# Altium schematic sheet L3_GSM.SchDoc
size 469 x 281 mm; SheetNumber: 1; SheetTotal: 1
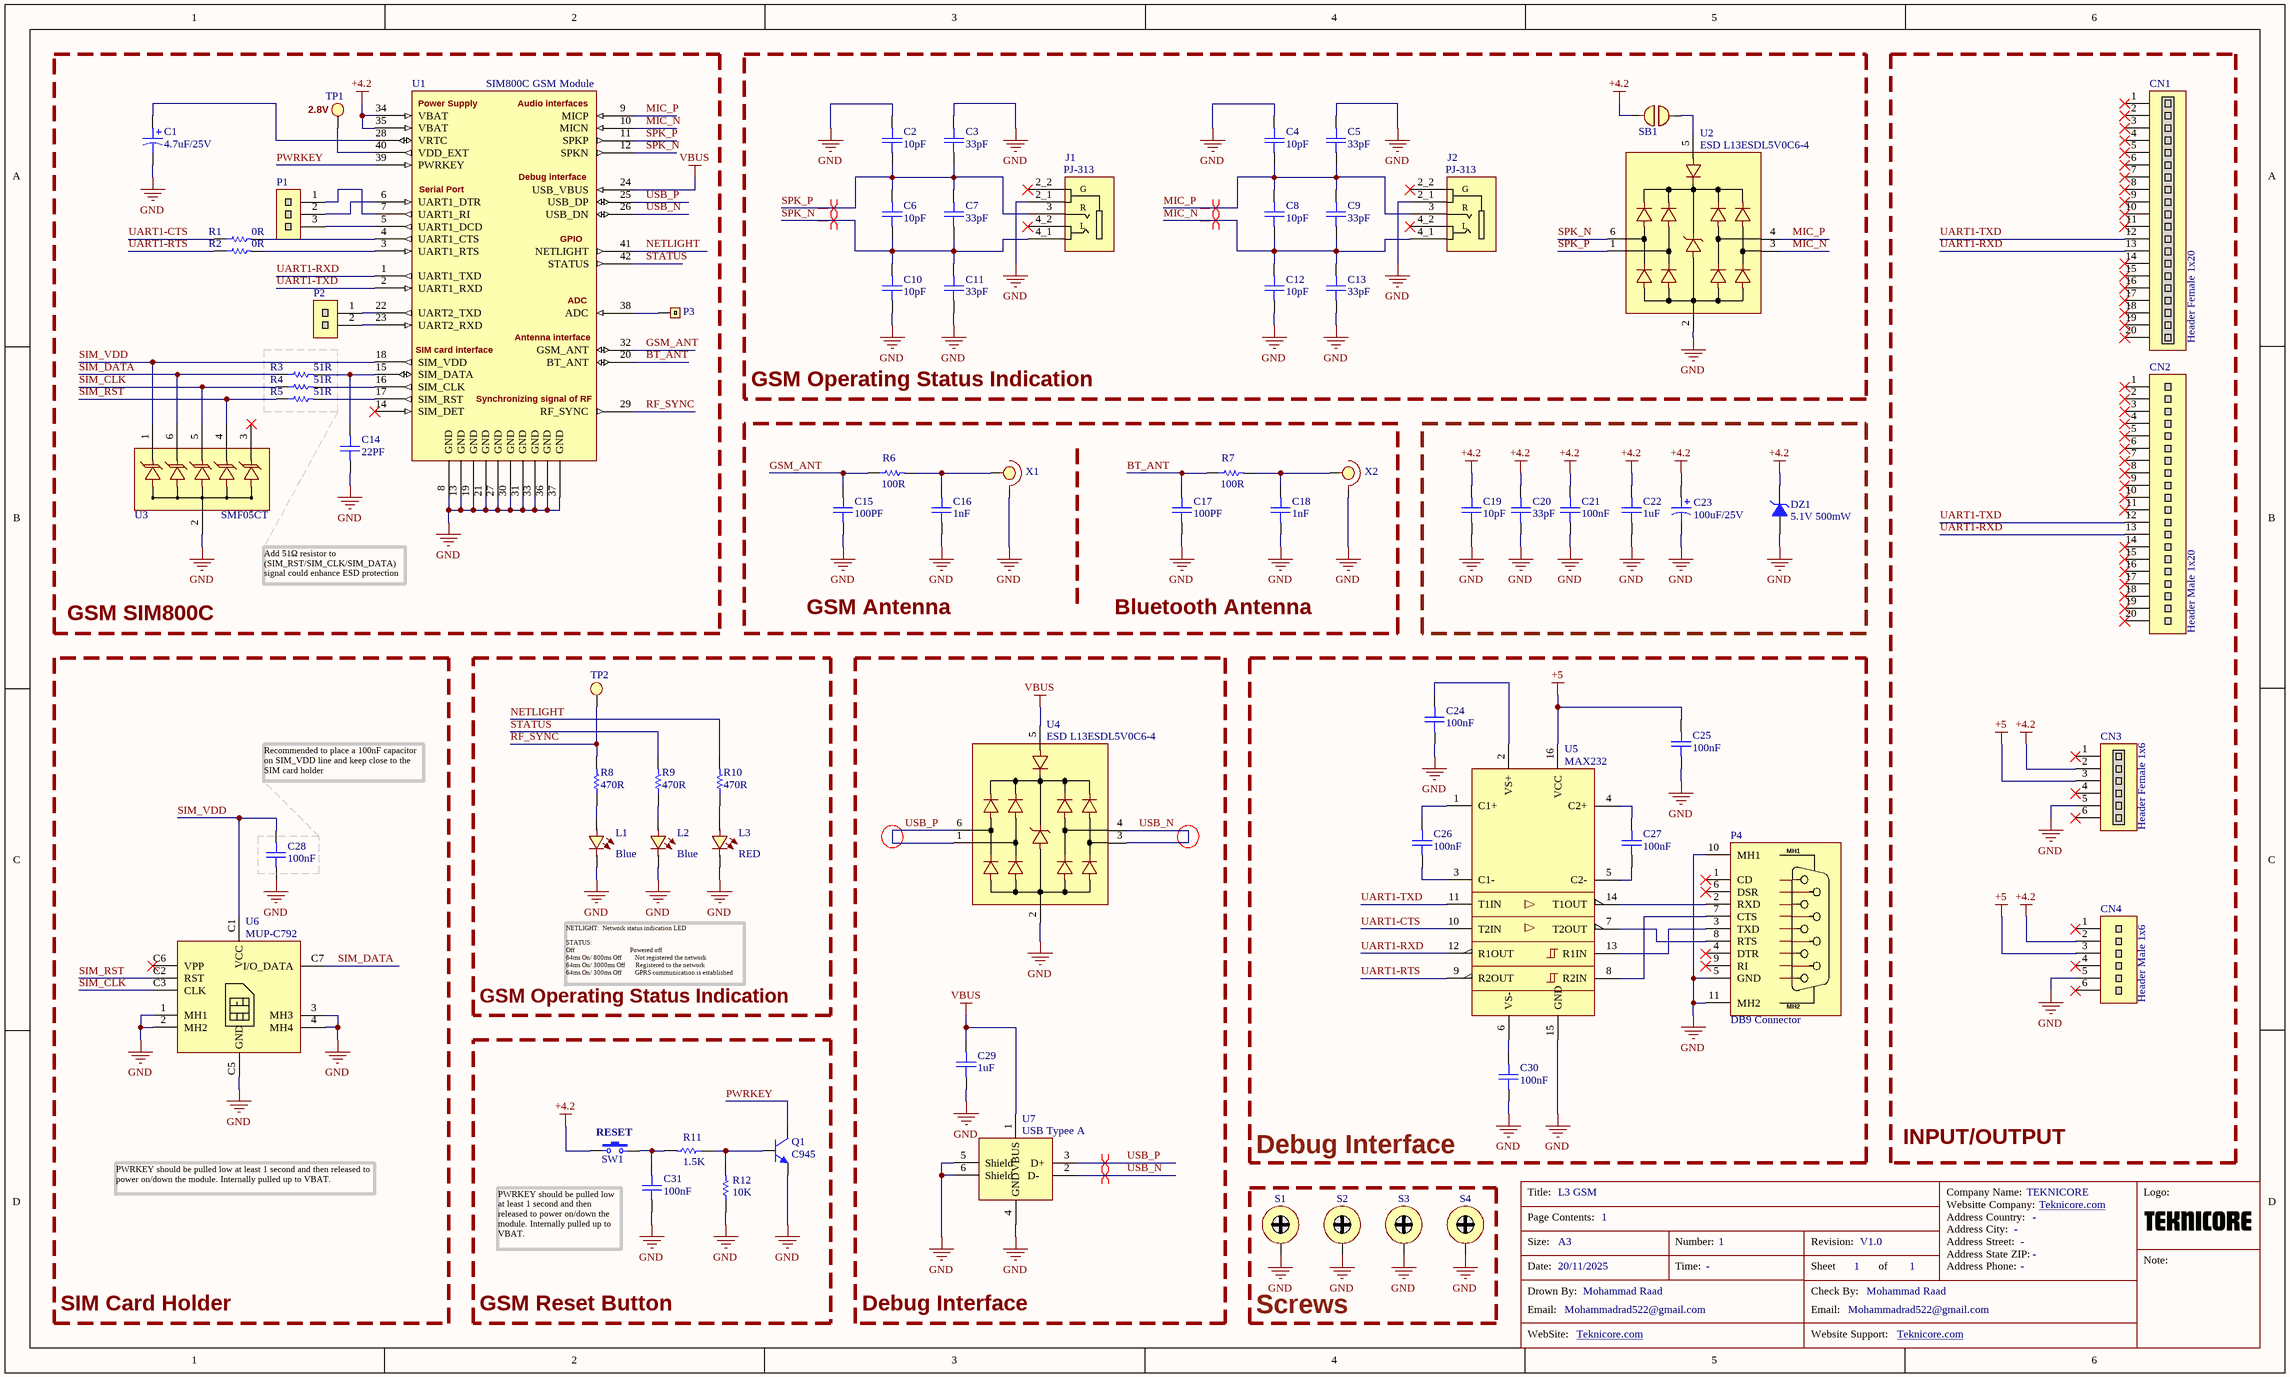
[diagram p0: L3_GSM.SchDoc]

## Parts
C1  4.7uF/25V  [CAP_EL_B]
C2  10pF  [CAP1206]
C3  33pF  [CAP1206]
C4  10pF  [CAP1206]
C5  33pF  [CAP1206]
C6  10pF  [CAP1206]
C7  33pF  [CAP1206]
C8  10pF  [CAP1206]
C9  33pF  [CAP1206]
C10  10pF  [CAP1206]
C11  33pF  [CAP1206]
C12  10pF  [CAP1206]
C13  33pF  [CAP1206]
C14  22PF  [CAP1206]
C15  100PF  [CAP1206]
C16  1nF  [CAP1206]
C17  100PF  [CAP1206]
C18  1nF  [CAP1206]
C19  10pF  [CAP1206]
C20  33pF  [CAP1206]
C21  100nF  [CAP1206]
C22  1uF  [CAP1206]
C23  100uF/25V  [CAP_EL_0810]
C24  100nF  [CAP1206]
C25  100nF  [CAP1206]
C26  100nF  [CAP1206]
C27  100nF  [CAP1206]
C28  100nF  [CAP1206]
C29  1uF  [CAP1206]
C30  100nF  [CAP1206]
C31  100nF  [CAP1206]
CN1  Header Female 1x20  [HDR_F_1x20PIN_0.2"]
CN2  Header Male 1x20  [HDR_M_1x20PIN_0.2"]
CN3  Header Female 1x6  [HDR_F_1x6PIN_0.2"]
CN4  Header Male 1x6  [HDR_M_1x6PIN_0.2"]
DZ1  5.1V 500mW  [Diode SOD-80C]
J1  PJ-313  [PJ-313_PJ-313(Primary)]
J2  PJ-313  [PJ-313_PJ-313(Primary)]
L1  Blue  [LED 1206]
L2  Blue  [LED 1206]
L3  RED  [LED 1206]
P1  Header Male 1x3  [HDR 1X3-2.54mm]  (value not drawn)
P2  Header Male 1x2  [HDR 1X2-2.54mm]  (value not drawn)
P3  Header 1x1  [HDR 1X1-2.54mm]  (value not drawn)
P4  DB9 Connector  [DB9 Female]
Q1  C945  [SOT23_M]
R1  0R  [Resistor_SMD_1206]
R2  0R  [Resistor_SMD_1206]
R3  51R  [Resistor_SMD_1206]
R4  51R  [Resistor_SMD_1206]
R5  51R  [Resistor_SMD_1206]
R6  100R  [Resistor_SMD_1206]
R7  100R  [Resistor_SMD_1206]
R8  470R  [Resistor_SMD_1206]
R9  470R  [Resistor_SMD_1206]
R10  470R  [Resistor_SMD_1206]
R11  1.5K  [Resistor_SMD_1206]
R12  10K  [Resistor_SMD_1206]
S1  Screw  [Screw 3mm-Invirons 0.254mm]  (value not drawn)
S2  Screw  [Screw 3mm-Invirons 0.254mm]  (value not drawn)
S3  Screw  [Screw 3mm-Invirons 0.254mm]  (value not drawn)
S4  Screw  [Screw 3mm-Invirons 0.254mm]  (value not drawn)
SB1  Solder Bridge  [SolderBridge_Small_NC (70x50)(20)mil]  (value not drawn)
SW1  Push Button  [SWPBS_SPST_6X3X5]  (value not drawn)
T?  Title: L3 GSM  Page Conteents: 1  Size: A3  Drawn By: Mohammad Raad  Drown By (Email): Mohammadrad522@gmail.com  Website: Teknicore.com  Date: 20/11/2025  Reversion: V1.0  Company Name: TEKNICORE  (hidden comment: Title Block)  (graphical)
TP1  Test Point  [TestPoint_SMD_Circle_1.5mm]  (value not drawn)
TP2  Test Point  [TestPoint_SMD_Circle_1.5mm]  (value not drawn)
U1  SIM800C GSM Module  [GSM_SIM800C]
U2  ESD L13ESDL5V0C6-4  [SOT23-6L]
U3  SMF05CT  [CS-88-N]
U4  ESD L13ESDL5V0C6-4  [SOT23-6L]
U5  MAX232  [SOIC16]
U6  MUP-C792  [Micro_SIM_Card_MUP]
U7  USB Typee A  [USB2.5-2H4C]
X1  RF Connector  [ANT_SMA-Right]  (value not drawn)
X2  RF Connector  [ANT_SMA-Right]  (value not drawn)

## Blocks framed on the sheet
GSM SIM800C: C1 C14 P1-P3 R1-R5 TP1 U1 U3
GSM Operating Status Indication: C2-C13 J1 J2 SB1 U2
INPUT/OUTPUT: CN1-CN4
SIM Card Holder: C28 U6
GSM Operating Status Indication: L1-L3 R8-R10 TP2
Debug Interface: C29 U4 U7
Debug Interface: C24-C27 C30 P4 U5
GSM Reset Button: C31 Q1 R11 R12 SW1
Screws: S1-S4

## Nets
+4.2: C19.2 C20.2 C21.2 C22.2 C23.1 CN3.2 CN4.2 DZ1.2(K) SB1.2 SW1.1(Button) U1.34(VBAT) U1.35(VBAT)
+5: C25.2 CN3.3 CN4.3 U5.16(VCC)
GND: C1.2 C2.2 C3.2 C4.2 C5.2 C10.1 C11.1 C12.1 C13.1 C14.1 C15.1 C16.1 C17.1 C18.1 C19.1 C20.1 C21.1 C22.1 C23.2 C24.1 C25.1 C28.1 C29.1 C30.1 C31.1 CN3.5 CN4.5 DZ1.1(A) J1.2_1 J2.2_1 L1.K L2.K L3.K P4.5(GND) P4.10(MH1) P4.11(MH2) Q1.2(E) R12.1 S1.S S2.S S3.S S4.S U1.8(GND) U1.13(GND) U1.19(GND) U1.21(GND) U1.27(GND) U1.30(GND) U1.31(GND) U1.33(GND) U1.36(GND) U1.37(GND) U2.2(GND) U3.2 U4.2(GND) U5.15(GND) U6.1(MH1) U6.2(MH2) U6.3(MH3) U6.4(MH4) U6.C5(GND) U7.4(GND) U7.5(Shield) U7.6(Shield) X1.2 X2.2
VBUS: C29.2 U1.24(USB_VBUS) U4.5(VBUS) U7.1(VBUS)
BT_ANT: C17.2 R7.1 U1.20(BT_ANT)
GSM_ANT: C15.2 R6.1 U1.32(GSM_ANT)
MIC_N: C8.1 C9.1 C12.2 C13.2 J2.4_1(L) U1.10(MICN) U2.3(I/O2)
MIC_P: C4.1 C5.1 C8.2 C9.2 J2.3 U1.9(MICP) U2.4(I/O2)
NETLIGHT: R10.2 U1.41(NETLIGHT)
PWRKEY: Q1.3(C) U1.39(PWRKEY)
RF_SYNC: R8.2 TP2.1 U1.29(RF_SYNC)
SIM_CLK: R4.1 U3.5 U6.C3(CLK)
SIM_DATA: R3.1 U3.6 U6.C7(I/O_DATA)
SIM_RST: R5.1 U3.4 U6.C2(RST)
SIM_VDD: C28.2 U1.18(SIM_VDD) U3.1 U6.C1(VCC)
SPK_N: C6.1 C7.1 C10.2 C11.2 J1.4_1(L) U1.12(SPKN) U2.6(I/O1)
SPK_P: C2.1 C3.1 C6.2 C7.2 J1.3 U1.11(SPKP) U2.1(I/O1)
STATUS: R9.2 U1.42(STATUS)
UART1-CTS: R1.1 U5.10(T2IN)
UART1-RTS: R2.1 U5.9(R2OUT)
UART1-RXD: CN1.13 CN2.13 U1.1(UART1_TXD) U5.12(R1OUT)
UART1-TXD: CN1.12 CN2.12 U1.2(UART1_RXD) U5.11(T1IN)
USB_N: U1.26(USB_DN) U4.3(I/O2) U4.4(I/O2) U7.2(D-)
USB_P: U1.25(USB_DP) U4.1(I/O1) U4.6(I/O1) U7.3(D+)
NetC1_1: C1.1 U1.28(VRTC)
NetC14_2: C14.2 R3.2 U1.15(SIM_DATA)
NetC16_2: C16.2 R6.2 X1.1
NetC18_2: C18.2 R7.2 X2.1
NetC24_2: C24.2 U5.2(VS+)
NetC26_1: C26.1 U5.3(C1-)
NetC26_2: C26.2 U5.1(C1+)
NetC27_1: C27.1 U5.5(C2-)
NetC27_2: C27.2 U5.4(C2+)
NetC30_2: C30.2 U5.6(VS-)
NetC31_2: C31.2 R11.2 SW1.2
NetL1_A: L1.A R8.1
NetL2_A: L2.A R9.1
NetL3_A: L3.A R10.1
NetP1_1: P1.1 U1.7(UART1_RI)
NetP1_2: P1.2 U1.6(UART1_DTR)
NetP1_3: P1.3 U1.5(UART1_DCD)
NetP2_1: P2.1 U1.22(UART2_TXD)
NetP2_2: P2.2 U1.23(UART2_RXD)
NetP3_1: P3.1 U1.38(ADC)
NetP4_2: P4.2(RXD) U5.14(T1OUT)
NetP4_3: P4.3(TXD) U5.13(R1IN)
NetP4_7: P4.7(CTS) U5.8(R2IN)
NetP4_8: P4.8(RTS) U5.7(T2OUT)
NetQ1_1: Q1.1(B) R11.1 R12.2
NetR1_2: R1.2 U1.4(UART1_CTS)
NetR2_2: R2.2 U1.3(UART1_RTS)
NetR4_2: R4.2 U1.16(SIM_CLK)
NetR5_2: R5.2 U1.17(SIM_RST)
NetSB1_1: SB1.1 U2.5(VBUS)
NetTP1_1: TP1.1 U1.40(VDD_EXT)

Not connected (* = marked no-connect by the designer): CN1 1* 2* 3* 4* 5* 6* 7* 8* 9* 10* 11* 14* 15* 16* 17* 18* 19* 20*; CN2 1* 2* 3* 4* 5* 6* 7* 8* 9* 10* 11* 14* 15* 16* 17* 18* 19* 20*; CN3 1* 4* 6*; CN4 1* 4* 6*; J1 2_2(2)* 4_2(L)*; J2 2_2(2)* 4_2(L)*; P4 1(CD)* 4(DTR)* 6(DSR)* 9(RI)*; U1 14(SIM_DET)*; U3 3*; U6 C6(VPP)*

## Layout directives
differential pair: MIC_N, MIC_P, SPK_N, SPK_P, USB_N, USB_P

## Notes on the sheet
- (near TP1) 2.8V
- (near U3) Add 51Ω resistor to (SIM_RST/SIM_CLK/SIM_DATA) signal could enhance ESD protection
- GSM Antenna
- Bluetooth Antenna
- Recommended to place a 100nF capacitor on SIM_VDD line and keep close to the SIM card holder
- NETLIGHT:  Network status indication LED
  STATUS:
  Off                                     Powered off
  64ms On/ 800ms Off         Not registered the network
  64ms On/ 3000ms Off       Registered to the network
  64ms On/ 300ms Off         GPRS communication is established
- (near SW1) RESET
- PWRKEY should be pulled low at least 1 second and then released to power on/down the module. Internally pulled up to VBAT.
- (in symbol GSM-SIM800C) Power Supply; Audio interfaces; Debug interface; Serial Port; GPIO; Antenna interface; SIM card interface; Synchronizing signal of RF
- (in symbol PJ-313) G; R
- (in symbol Title Block) Title:; Company Name:; Logo:; Websitte Company:; Page Contents:; Address Country:; Address City:; Size:; Number:; Revision:; Address Street:; Address State ZIP:; Note:; Date:; Time:; Sheet; of; Address Phone:; Drown By:; Check By:; Email:; WebSite:; Website Support:

## Library data of the parts
C1 C23 = Capacitor Electorolytic
C2-C22 C24-C31 = Capacitor Poliester & Ceramic
DZ1 = Zener Diode
J1 J2 = PJ-313: DC DC Converter  Output       Input; MF: ADC Telecommunications; MP: PJ313; SnapEDA_Link: https://www.snapeda.com/parts/PJ313/ADC/view-part/?ref=snap; Package: None; Check_prices: https://www.snapeda.com/parts/PJ313/ADC/view-part/?ref=eda; Value: *
L1-L3 = LED
P3 = Header Male 1x1
P4 = DB9 Connector: Receptacle Assembly, 9 Position, Right Angle; PackageDocument: O; Positions: 9; Published: 15-Jun-2001; LatestRevisionDate: 17-Jul-2002; LatestRevisionNote: Re-released for DXP Platform.; DatasheetDocument: 1-Sep-1999; PackageReference: 788750; Publisher: Altium Limited; Orientation: Right Angle; Gender: Receptacle
Q1 = C945: NPN Silicon Epitaxial Planar Transistor
R1-R12 = Resistor
SB1 = Solder Bridge Short (NC): Solder Bridge Jumper
SW1 = Push Button 2PIN
TP1 TP2 = TestPoint
U1 = GSM-SIM800C: The SIM800C is a compact and versatile GSM module that supports 2G connectivity for voice, SMS, and data transmission. It operates on quad-band frequencies (850/900/1800/1900 MHz), making it compatible with most GSM networks worldwide. The module features low power consumption, integrated TCP/IP protocol, and supports AT commands for easy integration with microcontrollers like Arduino, ESP8266, and Raspberry Pi. It is widely used in IoT projects, remote monitoring, and communication applications.
U3 = ESD Protection Diode Array 5 Line: ESD Protection Diode Array, / 5-Line
U6 = Micro SIM Card: Micro SIM Card 7Pins
X1 X2 = Antenna GSM: RF Connector for GSM.
T? = Title Block: Number Sheet: 1; This Sheet Number: 1; All Sheet Number: 1; Checked By: Mohammad Raad; Checked By (Email): Mohammadrad522@gmail.com; Website Support: Teknicore.com; Website Company: Teknicore.com; Address Country: -; Address City: -; Address Country Street: -; Address State ZIP: -; Address Phone: -; Time:: -